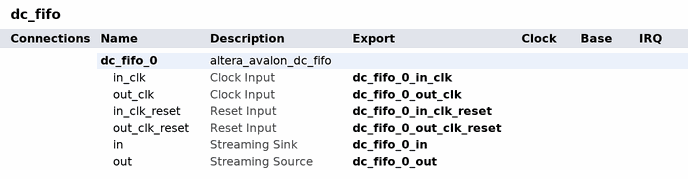
[diagram p0: system contents]
# Platform Designer (Qsys) system dc_fifo, Cyclone IV E EP4CE115F29C7
# Parameters at their usual value, and those the tool derives, are not listed.
package require -exact qsys 22.1
create_system dc_fifo
set_project_property DEVICE_FAMILY {Cyclone IV E}
set_project_property DEVICE EP4CE115F29C7

add_instance dc_fifo_0 altera_avalon_dc_fifo 22.1
set_instance_parameter_value dc_fifo_0 BITS_PER_SYMBOL 8
set_instance_parameter_value dc_fifo_0 ERROR_WIDTH 1
set_instance_parameter_value dc_fifo_0 FIFO_DEPTH 128
set_instance_parameter_value dc_fifo_0 USE_PACKETS 1

# exported interfaces
add_interface dc_fifo_0_in avalon_streaming sink
set_interface_property dc_fifo_0_in EXPORT_OF dc_fifo_0.in
add_interface dc_fifo_0_in_clk clock sink
set_interface_property dc_fifo_0_in_clk EXPORT_OF dc_fifo_0.in_clk
add_interface dc_fifo_0_in_clk_reset reset sink
set_interface_property dc_fifo_0_in_clk_reset EXPORT_OF dc_fifo_0.in_clk_reset
add_interface dc_fifo_0_out avalon_streaming source
set_interface_property dc_fifo_0_out EXPORT_OF dc_fifo_0.out
add_interface dc_fifo_0_out_clk clock sink
set_interface_property dc_fifo_0_out_clk EXPORT_OF dc_fifo_0.out_clk
add_interface dc_fifo_0_out_clk_reset reset sink
set_interface_property dc_fifo_0_out_clk_reset EXPORT_OF dc_fifo_0.out_clk_reset

set_interconnect_requirement {$system} qsys_mm.clockCrossingAdapter HANDSHAKE
set_interconnect_requirement {$system} qsys_mm.enableEccProtection FALSE
set_interconnect_requirement {$system} qsys_mm.insertDefaultSlave FALSE
set_interconnect_requirement {$system} qsys_mm.maxAdditionalLatency 1

save_system dc_fifo.qsys
